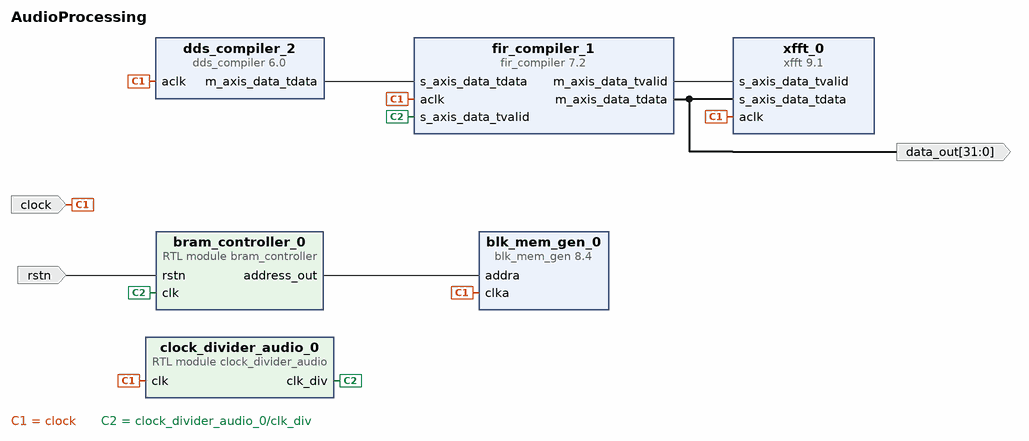
[diagram p0: block diagram of the top level]
# Vivado block design AudioProcessing, xc7z020clg400-3, Vivado 2019.1
create_bd_design AudioProcessing

create_bd_port -dir I -type clk clock
set_property -dict {CONFIG.FREQ_HZ 100000000} [get_bd_ports clock]
create_bd_port -dir I -type rst rstn
create_bd_port -dir O -from 31 -to 0 -type data data_out

create_bd_cell -type ip -vlnv xilinx.com:ip:blk_mem_gen:8.4 blk_mem_gen_0
set_property -dict [list \
  CONFIG.Coe_File {../../../../../../../../Matlab Files/audio_coefficients.coe} \
  CONFIG.Enable_32bit_Address false \
  CONFIG.Enable_A Always_Enabled \
  CONFIG.Load_Init_File true \
  CONFIG.Memory_Type Single_Port_ROM \
  CONFIG.Port_A_Write_Rate 0 \
  CONFIG.Register_PortA_Output_of_Memory_Primitives true \
  CONFIG.Use_RSTA_Pin false \
  CONFIG.Write_Depth_A 44100 \
  CONFIG.Write_Width_A 16 \
  CONFIG.use_bram_block Stand_Alone \
] [get_bd_cells blk_mem_gen_0]
create_bd_cell -type module -reference bram_controller bram_controller_0
create_bd_cell -type ip -vlnv xilinx.com:ip:fir_compiler:7.2 fir_compiler_1
set_property -dict [list \
  CONFIG.Clock_Frequency 100.0 \
  CONFIG.CoefficientSource Vector \
  CONFIG.CoefficientVector -2,9,-17,-23,289,289,-23,-17,9,-2 \
  CONFIG.Coefficient_File no_coe_file_loaded \
  CONFIG.Coefficient_Fractional_Bits 0 \
  CONFIG.Coefficient_Sets 1 \
  CONFIG.Coefficient_Sign Signed \
  CONFIG.Coefficient_Structure Inferred \
  CONFIG.Coefficient_Width 10 \
  CONFIG.Data_Width 16 \
  CONFIG.Filter_Architecture Systolic_Multiply_Accumulate \
  CONFIG.Output_Rounding_Mode Full_Precision \
  CONFIG.Output_Width 26 \
  CONFIG.Quantization Integer_Coefficients \
  CONFIG.Sample_Frequency 0.0441 \
] [get_bd_cells fir_compiler_1]
create_bd_cell -type module -reference clock_divider_audio clock_divider_audio_0
create_bd_cell -type ip -vlnv xilinx.com:ip:dds_compiler:6.0 dds_compiler_2
set_property -dict [list \
  CONFIG.Has_Phase_Out false \
  CONFIG.Latency 7 \
  CONFIG.M_DATA_Has_TUSER Not_Required \
  CONFIG.Noise_Shaping None \
  CONFIG.Output_Frequency1 0 \
  CONFIG.Output_Selection Sine \
  CONFIG.Output_Width 16 \
  CONFIG.PINC1 100000000001000 \
  CONFIG.Parameter_Entry Hardware_Parameters \
  CONFIG.Phase_Width 16 \
] [get_bd_cells dds_compiler_2]
create_bd_cell -type ip -vlnv xilinx.com:ip:xfft:9.1 xfft_0
set_property -dict [list \
  CONFIG.input_width 26 \
  CONFIG.number_of_stages_using_block_ram_for_data_and_phase_factors 3 \
  CONFIG.phase_factor_width 8 \
  CONFIG.scaling_options unscaled \
  CONFIG.target_clock_frequency 100 \
] [get_bd_cells xfft_0]

# ---- connections ----

connect_bd_net [get_bd_ports clock] \
  [get_bd_pins blk_mem_gen_0/clka] [get_bd_pins fir_compiler_1/aclk] [get_bd_pins clock_divider_audio_0/clk] \
  [get_bd_pins dds_compiler_2/aclk] [get_bd_pins xfft_0/aclk]
connect_bd_net [get_bd_pins bram_controller_0/address_out] [get_bd_pins blk_mem_gen_0/addra]
connect_bd_net [get_bd_ports rstn] [get_bd_pins bram_controller_0/rstn]
connect_bd_net [get_bd_pins fir_compiler_1/m_axis_data_tdata] [get_bd_ports data_out] [get_bd_pins xfft_0/s_axis_data_tdata]
connect_bd_net [get_bd_pins clock_divider_audio_0/clk_div] [get_bd_pins bram_controller_0/clk] [get_bd_pins fir_compiler_1/s_axis_data_tvalid]
connect_bd_net [get_bd_pins dds_compiler_2/m_axis_data_tdata] [get_bd_pins fir_compiler_1/s_axis_data_tdata]
connect_bd_net [get_bd_pins fir_compiler_1/m_axis_data_tvalid] [get_bd_pins xfft_0/s_axis_data_tvalid]

validate_bd_design
save_bd_design
